# EAGLE design io-board-b-1 (EAGLE 8.4.3)
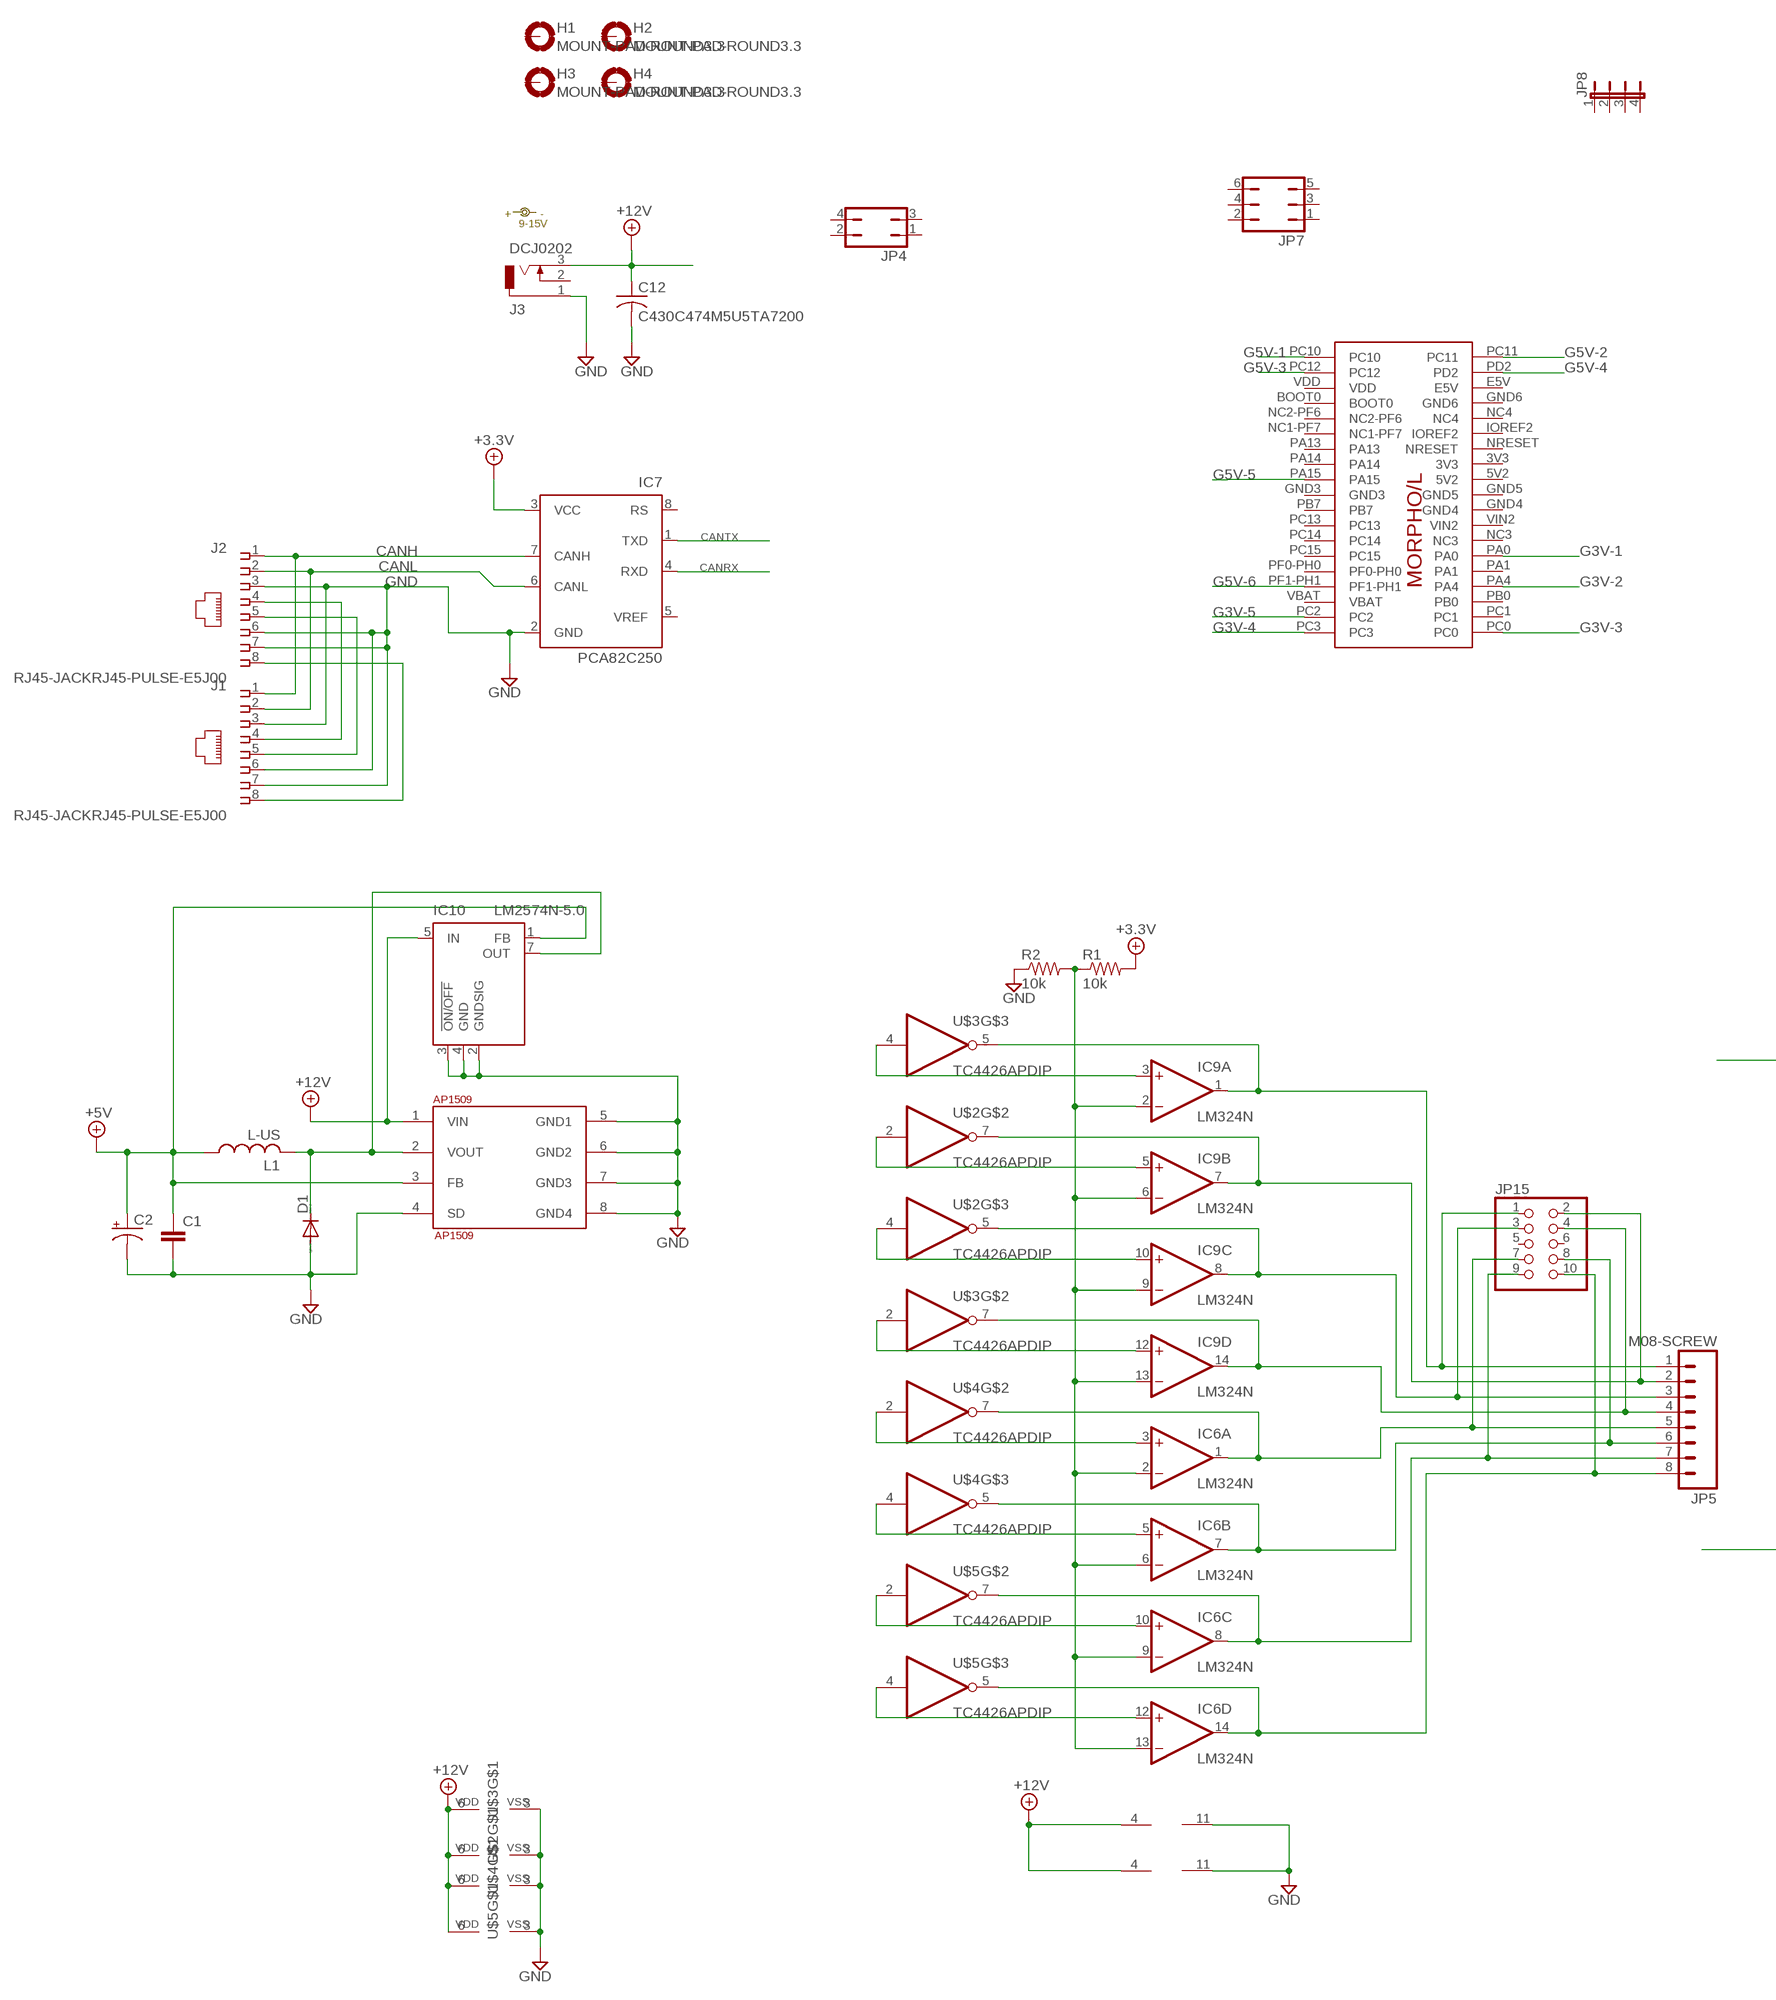
[diagram p0: schematic, sheet 1, part 1 of 2]
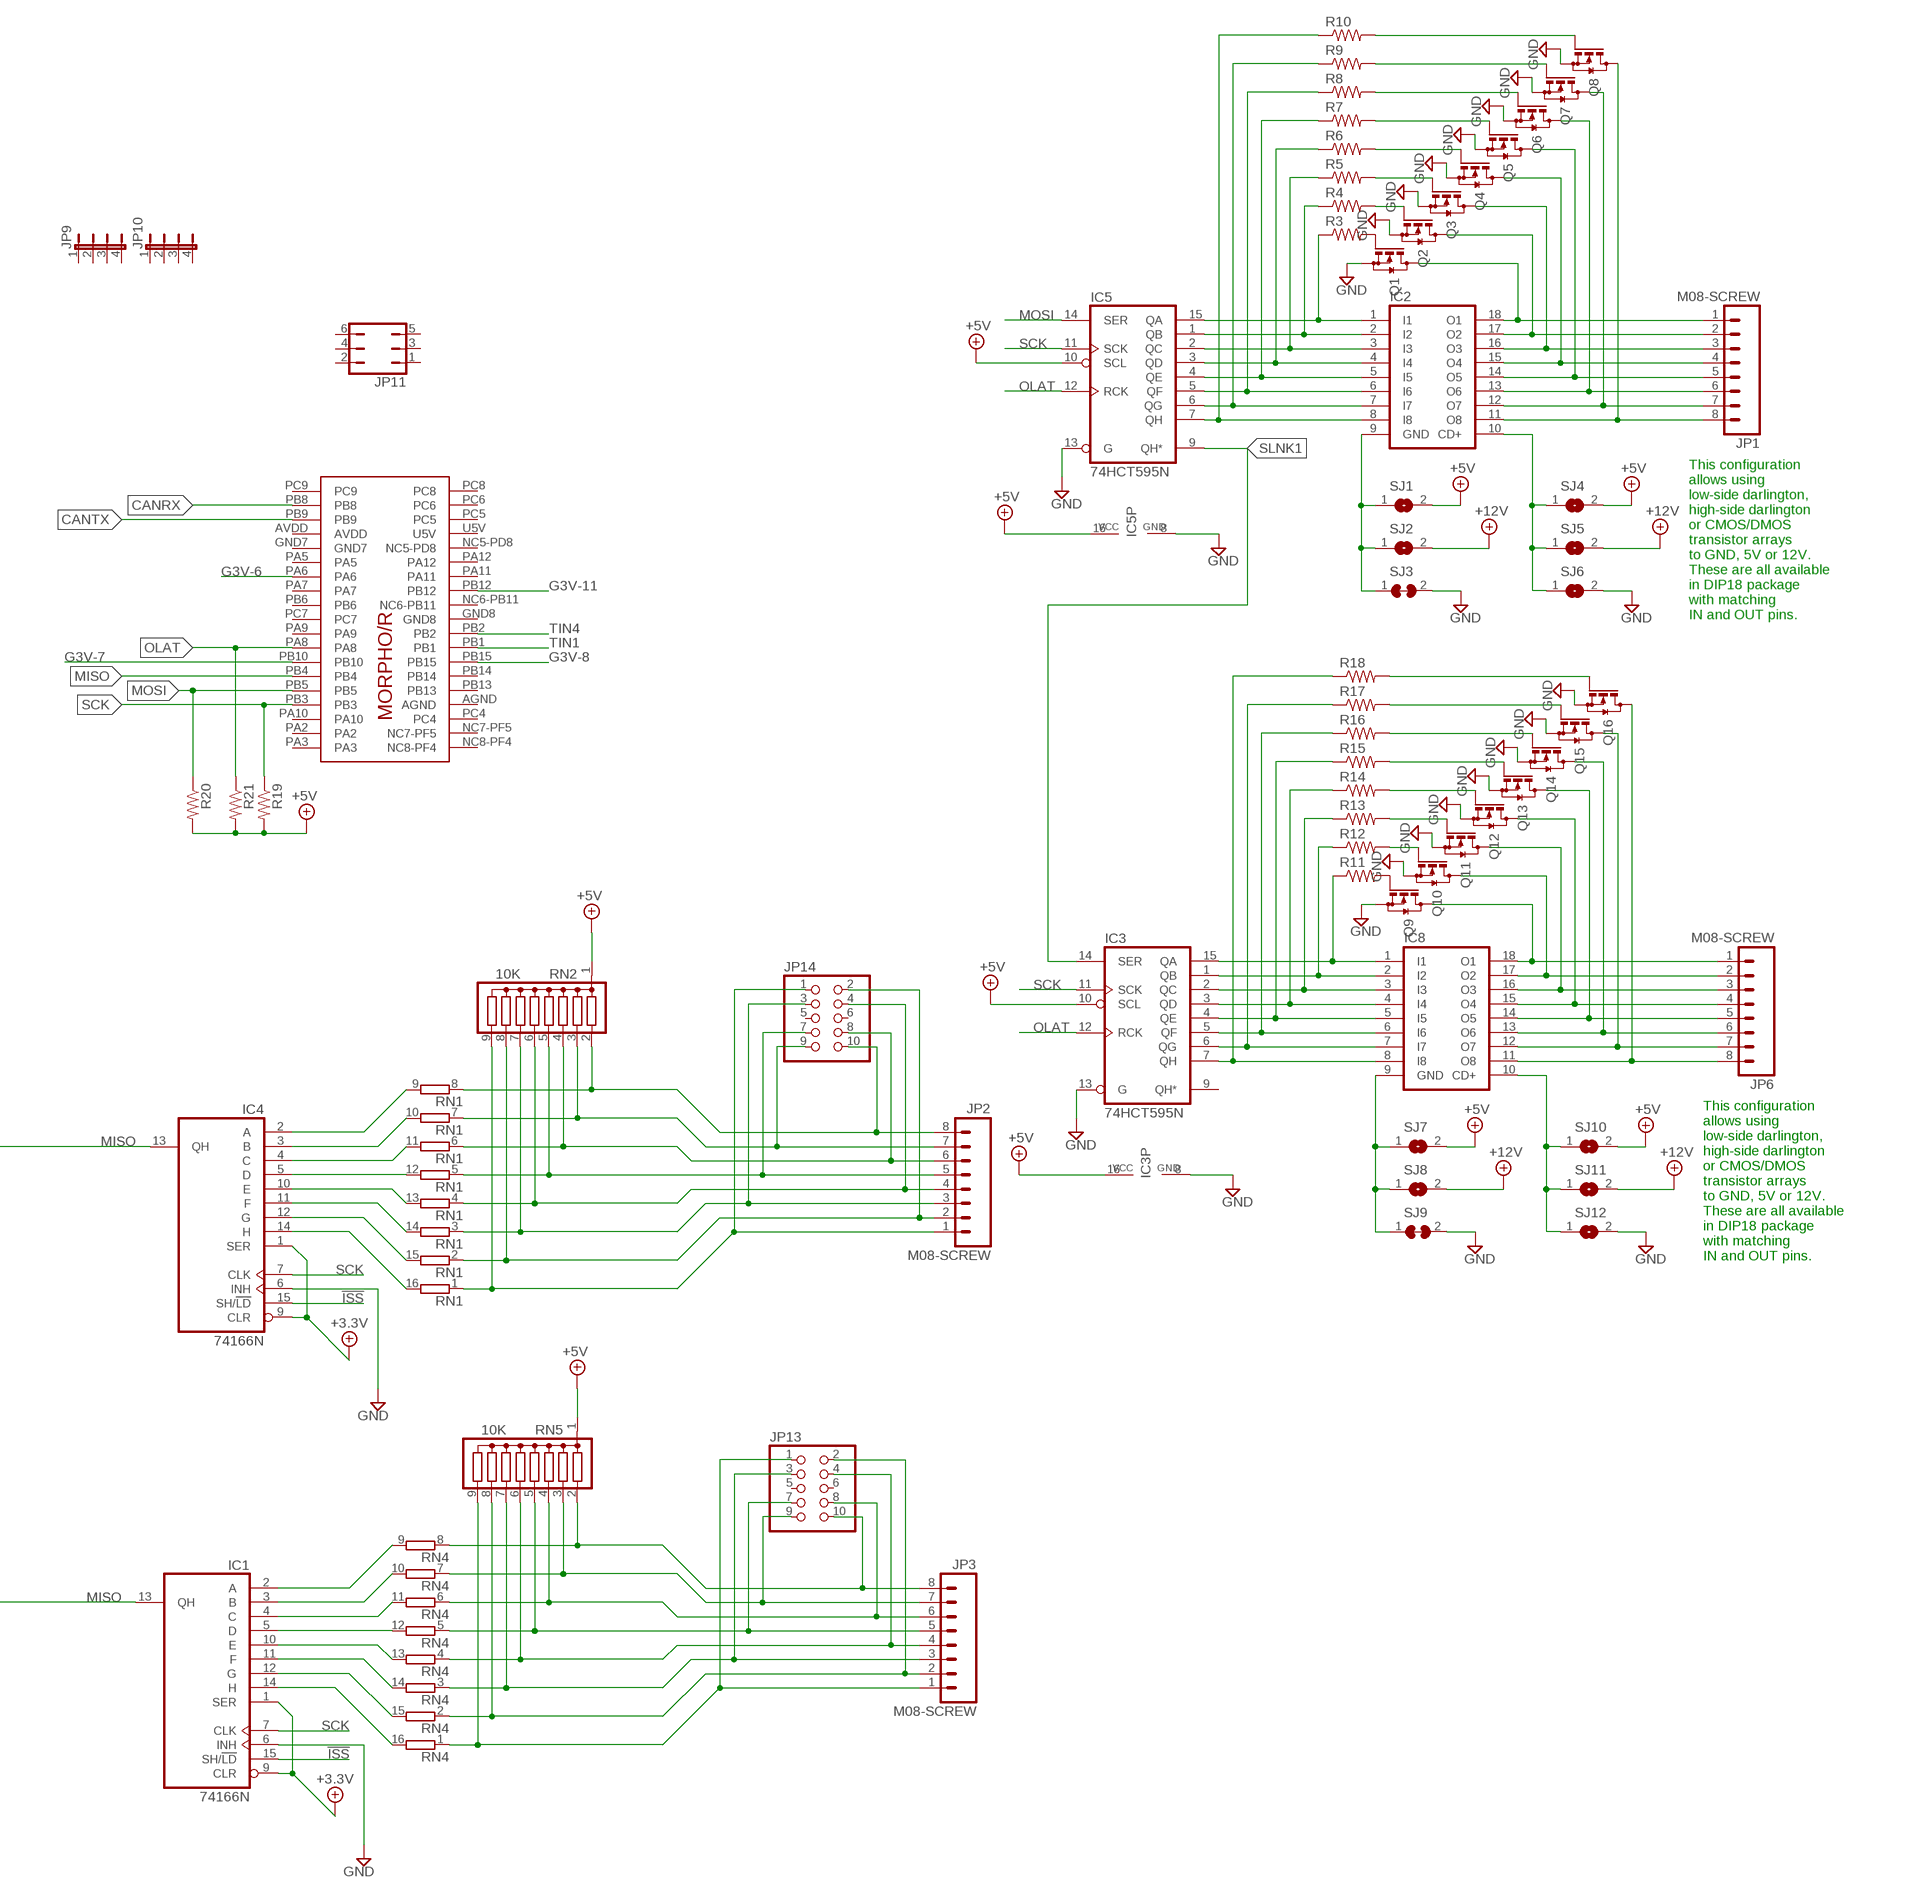
[diagram p1: schematic, sheet 1, part 2 of 2]

## Parts
+12V  9-15V  DOC-POWER_LABEL  [POWER_USAGE]
AP1509  AP1509  [SO-08]
C1  C-EUC1206  [C1206]
C2  CPOL-USE2.5-5  [E2,5-5]
C12  C430C474M5U5TA7200  C-US075-032X103  [C075-032X103]
D1  DIODE-DO41-7.6  [DO41-7.6]
H1  MOUNT-PAD-ROUND3.3  [3,3-PAD]
H2  MOUNT-PAD-ROUND3.3  [3,3-PAD]
H3  MOUNT-PAD-ROUND3.3  [3,3-PAD]
H4  MOUNT-PAD-ROUND3.3  [3,3-PAD]
IC1  74166N  [DIL16]
IC2  ULN2803A  [DIL18-THIN]
IC3  74HCT595N  [DIL16]
IC4  74166N  [DIL16]
IC5  74HCT595N  [DIL16]
IC6  LM324N  [DIL14]
IC7  PCA82C250  [DIL08]
IC8  ULN2803A  [DIL18-THIN]
IC9  LM324N  [DIL14]
IC10  LM2574N-5.0  [DIL08]
J1  RJ45-JACKRJ45-PULSE-E5J00  [RJ45-PULSE-E5J88]
J2  RJ45-JACKRJ45-PULSE-E5J00  [RJ45-PULSE-E5J88]
J3  DCJ0202  [DCJ0202]
JP1  M08-SCREW  [1X08_TERMINAL]
JP2  M08-SCREW  [1X08_TERMINAL]
JP3  M08-SCREW  [1X08_TERMINAL]
JP4  JP2Q  [JP2Q]
JP5  M08-SCREW  [1X08_TERMINAL]
JP6  M08-SCREW  [1X08_TERMINAL]
JP7  JP3Q  [JP3Q]
JP8  JP4-FLAT  [JP4F]
JP9  JP4-FLAT  [JP4F]
JP10  JP4-FLAT  [JP4F]
JP11  JP3Q  [JP3Q]
JP13  PINHD-2X5CN  [CON10M]
JP14  PINHD-2X5CN  [CON10M]
JP15  PINHD-2X5CN  [CON10M]
L1  L-US  [L5-8,5]
Q1  BSS123  [SOT23]
Q2  BSS123  [SOT23]
Q3  BSS123  [SOT23]
Q4  BSS123  [SOT23]
Q5  BSS123  [SOT23]
Q6  BSS123  [SOT23]
Q7  BSS123  [SOT23]
Q8  BSS123  [SOT23]
Q9  BSS123  [SOT23]
Q10  BSS123  [SOT23]
Q11  BSS123  [SOT23]
Q12  BSS123  [SOT23]
Q13  BSS123  [SOT23]
Q14  BSS123  [SOT23]
Q15  BSS123  [SOT23]
Q16  BSS123  [SOT23]
R1  10k  R-US_R1206  [R1206]
R2  10k  R-US_R1206  [R1206]
R3  R-US_R0603  [R0603]
R4  R-US_R0603  [R0603]
R5  R-US_R0603  [R0603]
R6  R-US_R0603  [R0603]
R7  R-US_R0603  [R0603]
R8  R-US_R0603  [R0603]
R9  R-US_R0603  [R0603]
R10  R-US_R0603  [R0603]
R11  R-US_R0603  [R0603]
R12  R-US_R0603  [R0603]
R13  R-US_R0603  [R0603]
R14  R-US_R0603  [R0603]
R15  R-US_R0603  [R0603]
R16  R-US_R0603  [R0603]
R17  R-US_R0603  [R0603]
R18  R-US_R0603  [R0603]
R19  R-US_R0805  [R0805]
R20  R-US_R0805  [R0805]
R21  R-US_R0805  [R0805]
RN1  8R-P  [DIL16]
RN2  10K  G08R  [SIL9]
RN4  8R-P  [DIL16]
RN5  10K  G08R  [SIL9]
SJ1  SJ  [SJ-RND]
SJ2  SJ  [SJ-RND]
SJ3  SJ-C  [SJW-C]
SJ4  SJ  [SJ-RND]
SJ5  SJ  [SJ-RND]
SJ6  SJ  [SJ-RND]
SJ7  SJ  [SJ-RND]
SJ8  SJ  [SJ-RND]
SJ9  SJ-C  [SJW-C]
SJ10  SJ  [SJ-RND]
SJ11  SJ  [SJ-RND]
SJ12  SJ  [SJ-RND]
U$1  NUCLEO_64_GENERIC  [NUCLEO_BRD_BASE64]
U$2  TC4426APDIP  [DIL08-LONG]
U$3  TC4426APDIP  [DIL08-LONG]
U$4  TC4426APDIP  [DIL08-LONG]
U$5  TC4426APDIP  [DIL08-LONG]

## Nets
!ISS: IC1.15(SH/!LD) IC4.15(SH/!LD)
+3.3V: IC1.1(SER) IC1.9(CLR) IC4.1(SER) IC4.9(CLR) IC7.3(VCC) R1.2
+5V: AP1509.3(FB) C1.1 C2.+ IC3.10(SCL) IC3.16(VCC) IC5.10(SCL) IC5.16(VCC) IC10.1(FB) L1.1 R19.2 R20.2 R21.2 RN2.1 RN5.1 SJ1.2 SJ4.2 SJ7.2 SJ10.2
+12V: AP1509.1(VIN) C12.1 IC6.4(P:V+) IC9.4(P:V+) IC10.5(IN) J3.3 SJ2.2 SJ5.2 SJ8.2 SJ11.2 U$2.6(VDD) U$3.6(VDD) U$4.6(VDD) U$5.6(VDD)
CANH: IC7.7(CANH) J1.1 J2.1
CANL: IC7.6(CANL) J1.2 J2.2
CANRX: IC7.4(RXD) U$1.PB8
CANTX: IC7.1(TXD) U$1.PB9
CMPREF: IC6.2(A:-IN) IC6.6(B:-IN) IC6.9(C:-IN) IC6.13(D:-IN) IC9.2(A:-IN) IC9.6(B:-IN) IC9.9(C:-IN) IC9.13(D:-IN) R1.1 R2.2
G3V-1: U$1.PA0
G3V-2: U$1.PA4
G3V-3: U$1.PC0
G3V-4: U$1.PC3
G3V-5: U$1.PC2
G3V-6: U$1.PA6
G3V-7: U$1.PB10
G3V-8: U$1.PB15
G3V-11: U$1.PB12
G5V-1: U$1.PC10
G5V-2: U$1.PC11
G5V-3: U$1.PC12
G5V-4: U$1.PD2
G5V-5: U$1.PA15
G5V-6: U$1.PF1-PH1
GND: AP1509.4(SD) AP1509.5(GND1) AP1509.6(GND2) AP1509.7(GND3) AP1509.8(GND4) C1.2 C2.- C12.2 D1.A IC1.6(INH) IC3.8(GND) IC3.13(G) IC4.6(INH) IC5.8(GND) IC5.13(G) IC6.11(P:V-) IC7.2(GND) IC9.11(P:V-) IC10.2(GNDSIG) IC10.3(!ON/OFF) IC10.4(GND) J1.3 J1.6 J1.7 J2.3 J2.6 J2.7 J3.1 Q1.2(S) Q2.2(S) Q3.2(S) Q4.2(S) Q5.2(S) Q6.2(S) Q7.2(S) Q8.2(S) Q9.2(S) Q10.2(S) Q11.2(S) Q12.2(S) Q13.2(S) Q14.2(S) Q15.2(S) Q16.2(S) R2.1 SJ3.2 SJ6.2 SJ9.2 SJ12.2 U$2.3(VSS) U$3.3(VSS) U$4.3(VSS) U$5.3(VSS)
MISO: IC1.13(QH) IC4.13(QH) U$1.PB4
MOSI: IC5.14(SER) R20.1 U$1.PB5
N$1: IC2.1(I1) IC5.15(QA) R3.1
N$2: IC2.18(O1) JP1.1 Q1.3(D)
N$3: IC2.2(I2) IC5.1(QB) R4.1
N$4: J1.4 J2.4
N$5: J1.5 J2.5
N$6: JP3.8 JP13.10 RN4.8 RN5.2
N$7: IC2.17(O2) JP1.2 Q2.3(D)
N$8: IC2.3(I3) IC5.2(QC) R5.1
N$9: IC2.16(O3) JP1.3 Q3.3(D)
N$10: IC2.4(I4) IC5.3(QD) R6.1
N$11: IC2.15(O4) JP1.4 Q4.3(D)
N$12: IC2.5(I5) IC5.4(QE) R7.1
N$13: IC2.14(O5) JP1.5 Q5.3(D)
N$14: JP3.7 JP13.9 RN4.7 RN5.3
N$15: JP3.6 JP13.8 RN4.6 RN5.4
N$16: Q4.1(G) R6.2
N$17: IC2.6(I6) IC5.5(QF) R8.1
N$18: IC2.13(O6) JP1.6 Q6.3(D)
N$19: JP3.4 JP13.4 RN4.4 RN5.6
N$20: JP3.3 JP13.3 RN4.3 RN5.7
N$21: JP2.6 JP14.8 RN1.6 RN2.4
N$22: JP3.1 JP13.1 RN4.1 RN5.9
N$23: IC1.2(A) RN4.9
N$24: IC1.3(B) RN4.10
N$25: JP2.8 JP14.10 RN1.8 RN2.2
N$26: JP2.7 JP14.9 RN1.7 RN2.3
N$27: Q5.1(G) R7.2
N$28: JP2.5 JP14.7 RN1.5 RN2.5
N$29: IC1.4(C) RN4.11
N$30: IC1.5(D) RN4.12
N$31: IC1.10(E) RN4.13
N$32: IC1.11(F) RN4.14
N$33: JP2.4 JP14.4 RN1.4 RN2.6
N$34: JP2.3 JP14.3 RN1.3 RN2.7
N$35: JP2.2 JP14.2 RN1.2 RN2.8
N$36: JP2.1 JP14.1 RN1.1 RN2.9
N$37: IC1.12(G) RN4.15
N$38: IC1.14(H) RN4.16
N$39: IC2.7(I7) IC5.6(QG) R9.1
N$40: IC2.12(O7) JP1.7 Q7.3(D)
N$41: IC2.8(I8) IC5.7(QH) R10.1
N$42: IC2.11(O8) JP1.8 Q8.3(D)
N$43: Q6.1(G) R8.2
N$44: IC4.2(A) RN1.9
N$47: IC4.3(B) RN1.10
N$48: IC4.4(C) RN1.11
N$49: IC4.5(D) RN1.12
N$50: IC4.10(E) RN1.13
N$51: IC4.11(F) RN1.14
N$52: IC4.12(G) RN1.15
N$53: IC4.14(H) RN1.16
N$54: IC2.9(GND) SJ1.1 SJ2.1 SJ3.1
N$55: IC2.10(CD+) SJ4.1 SJ5.1 SJ6.1
N$56: IC3.15(QA) IC8.1(I1) R11.1
N$65: Q7.1(G) R9.2
N$75: IC8.11(O8) JP6.8 Q16.3(D)
N$76: IC8.9(GND) SJ7.1 SJ8.1 SJ9.1
N$77: IC8.10(CD+) SJ10.1 SJ11.1 SJ12.1
N$78: Q1.1(G) R3.2
N$79: Q2.1(G) R4.2
N$83: JP3.5 JP13.7 RN4.5 RN5.5
N$84: JP3.2 JP13.2 RN4.2 RN5.8
N$85: Q8.1(G) R10.2
N$87: IC8.18(O1) JP6.1 Q9.3(D)
N$88: Q3.1(G) R5.2
N$89: IC3.1(QB) IC8.2(I2) R12.1
N$91: IC8.17(O2) JP6.2 Q10.3(D)
N$92: IC3.2(QC) IC8.3(I3) R13.1
N$93: IC8.16(O3) JP6.3 Q11.3(D)
N$94: IC3.3(QD) IC8.4(I4) R14.1
N$95: IC8.15(O4) JP6.4 Q12.3(D)
N$96: IC3.4(QE) IC8.5(I5) R15.1
N$97: IC8.14(O5) JP6.5 Q13.3(D)
N$98: IC3.5(QF) IC8.6(I6) R16.1
N$99: IC8.13(O6) JP6.6 Q14.3(D)
N$100: IC3.6(QG) IC8.7(I7) R17.1
N$101: IC8.12(O7) JP6.7 Q15.3(D)
N$102: IC3.7(QH) IC8.8(I8) R18.1
N$104: Q9.1(G) R11.2
N$105: Q10.1(G) R12.2
N$106: Q11.1(G) R13.2
N$107: Q12.1(G) R14.2
N$108: Q13.1(G) R15.2
N$109: Q14.1(G) R16.2
N$110: Q15.1(G) R17.2
N$111: Q16.1(G) R18.2
OLAT: IC3.12(RCK) IC5.12(RCK) R21.1 U$1.PA8
PWR_POS: J1.8 J2.8
SCK: IC1.7(CLK) IC3.11(SCK) IC4.7(CLK) IC5.11(SCK) R19.1 U$1.PB3
SLNK1: IC3.14(SER) IC5.9(QH*)
SW: AP1509.2(VOUT) D1.C IC10.7(OUT) L1.2
TIN1: IC9.3(A:+IN) U$1.PB1 U$3.4(I)
TIN2: IC9.5(B:+IN) U$2.2(I)
TIN3: IC9.10(C:+IN) U$2.4(I)
TIN4: IC9.12(D:+IN) U$1.PB2 U$3.2(I)
TIN5: IC6.3(A:+IN) U$4.2(I)
TIN6: IC6.5(B:+IN) U$4.4(I)
TIN7: IC6.10(C:+IN) U$5.2(I)
TIN8: IC6.12(D:+IN) U$5.4(I)
TOUT1: IC9.1(A:OUT) JP5.1 JP15.1 U$3.5(O)
TOUT2: IC9.7(B:OUT) JP5.2 JP15.2 U$2.7(O)
TOUT3: IC9.8(C:OUT) JP5.3 JP15.3 U$2.5(O)
TOUT4: IC9.14(D:OUT) JP5.4 JP15.4 U$3.7(O)
TOUT5: IC6.1(A:OUT) JP5.5 JP15.7 U$4.7(O)
TOUT6: IC6.7(B:OUT) JP5.6 JP15.8 U$4.5(O)
TOUT7: IC6.8(C:OUT) JP5.7 JP15.9 U$5.7(O)
TOUT8: IC6.14(D:OUT) JP5.8 JP15.10 U$5.5(O)
Unconnected: H1.B3,3(MOUNT) H2.B3,3(MOUNT) H3.B3,3(MOUNT) H4.B3,3(MOUNT) IC3.9(QH*) IC7.5(VREF) IC7.8(RS) J3.2 JP4.1 JP4.2 JP4.3 JP4.4 JP7.1 JP7.2 JP7.3 JP7.4 JP7.5 JP7.6 JP8.1 JP8.2 JP8.3 JP8.4 JP9.1 JP9.2 JP9.3 JP9.4 JP10.1 JP10.2 JP10.3 JP10.4 JP11.1 JP11.2 JP11.3 JP11.4 JP11.5 JP11.6 JP13.5 JP13.6 JP14.5 JP14.6 JP15.5 JP15.6 U$1.BOOT0 U$1.IOREF2 U$1.NC1-PF7 U$1.NC2-PF6 U$1.NC3 U$1.NC4 U$1.NC5-PD8 U$1.NC6-PB11 U$1.NC7-PF5 U$1.NC8-PF4 U$1.NRESET U$1.PA1 U$1.PA2 U$1.PA3 U$1.PA5 U$1.PA7 U$1.PA9 U$1.PA10 U$1.PA11 U$1.PA12 U$1.PA13 U$1.PA14 U$1.PB0 U$1.PB6 U$1.PB7 U$1.PB13 U$1.PB14 U$1.PC1 U$1.PC4 U$1.PC5 U$1.PC6 U$1.PC7 U$1.PC8 U$1.PC9 U$1.PC13 U$1.PC14 U$1.PC15 U$1.PF0-PH0

## Notes on the sheet
- This configuration
  allows using
  low-side darlington,
  high-side darlington
  or CMOS/DMOS 
  transistor arrays 
  to GND, 5V or 12V. 
  These are all available 
  in DIP18 package 
  with matching 
  IN and OUT pins.
- This configuration
  allows using
  low-side darlington,
  high-side darlington
  or CMOS/DMOS 
  transistor arrays 
  to GND, 5V or 12V. 
  These are all available 
  in DIP18 package 
  with matching 
  IN and OUT pins.

## Power pins joined to a net without a drawn wire
3V3: U$1.3V3
5V2: U$1.5V2
AGND: U$1.AGND
AVDD: U$1.AVDD
E5V: U$1.E5V
GND: IC1.8(GND) IC4.8(GND)
GND3: U$1.GND3
GND4: U$1.GND4
GND5: U$1.GND5
GND6: U$1.GND6
GND7: U$1.GND7
GND8: U$1.GND8
U5V: U$1.U5V
VBAT: U$1.VBAT
VCC: IC1.16(VCC) IC4.16(VCC)
VDD: U$1.VDD
VIN2: U$1.VIN2

## Library data of the parts
+12V = SPCoast:DOC-POWER_LABEL
AP1509 = trainlib:AP1509
C1 = rcl:C-EU: CAPACITOR, European symbol
C2 = rcl:CPOL-US: POLARIZED CAPACITOR, American symbol
C12 = rcl:C-US: CAPACITOR, American symbol
D1 = diode:DIODE-: DIODE
H1-H4 = holes:MOUNT-PAD-ROUND: MOUNTING PAD, round
IC1 IC4 = 74xx-us:74*166: 8-bit parallel load SHIFT REGISTER
IC2 IC8 = trainlib:ULN2803A: DRIVER ARRAY
IC3 IC5 = 74xx-eu:74*595: 8-bit SHIFT REGISTER, output latch
IC6 IC9 = linear:LM324: OP AMP
IC7 = micro-philips:PCA82C250: CAN CONTROLLER INTERFACE; OC_FARNELL: 3692358; OC_NEWARK: unknown
IC10 = linear:LM2574?-*: SIMPLE SWITCHER 0.5A Step-Down Voltage Regulator Source: http://cache.national.com/ds/LM/LM2574.pdf
J1 J2 = trainlib:RJ45-JACK: Mod. Jack, Right Angle, 8 posiotion, 8 contatcs RJ45 Source: GLX-S-88M.pdf
J3 = con-jack:DCJ0202: DC POWER JACK Source: DCJ0202.pdf; OC_FARNELL: unknown; OC_NEWARK: unknown
JP1-JP3 JP5 JP6 = trainlib:M08-SCREW
JP4 = jumper:JP2Q: JUMPER
JP7 JP11 = jumper:JP3Q: JUMPER
JP8-JP10 = trainlib:JP4-FLAT: JUMPER
JP13-JP15 = trainlib:PINHD-2X5: PIN HEADER
L1 = trainlib:L-US
Q1-Q16 = transistor-small-signal:BSS123: N-CHANNEL MOS FET
R1-R21 = rcl:R-US_: RESISTOR, American symbol
RN1 RN4 = resistor-dil:8R-P: DIL RESISTOR; OC_FARNELL: unknown; OC_NEWARK: unknown
RN2 RN5 = resistor-sil:G08R: SIL RESISTOR; OC_FARNELL: unknown; OC_NEWARK: unknown
SJ1 SJ2 SJ4-SJ8 SJ10-SJ12 = trainlib:SJ: SMD solder JUMPER
SJ3 SJ9 = trainlib:SJ-C
U$1 = trainlib:NUCLEO_64_GENERIC
U$2-U$5 = trainlib:TC4426A: The TC4426A (dual inverter), 4427A (dual buffer) and 4428A (buffer+inverter) are improved buffer/drivers. They will not latch up under any conditions within their power and voltage ratings. They are not subject to damage when up to 5V of noise spiking (of either polarity) occurs on the ground pin. They can accept, without damage or logic upset, up to 500 mA of reverse current (of either polarity) being forced back into their outputs. All terminals are fully protected against up to 4 kV of electrostatic discharge. As MOSFET drivers, the TC4426A/4427A/4428A can easily switch 1000 pF gate capacitances in under 30 ns, and provide low enough impedances in both the ON and OFF states to ensure the MOSFET's intended state will not be affected, even by large transients.

## Board
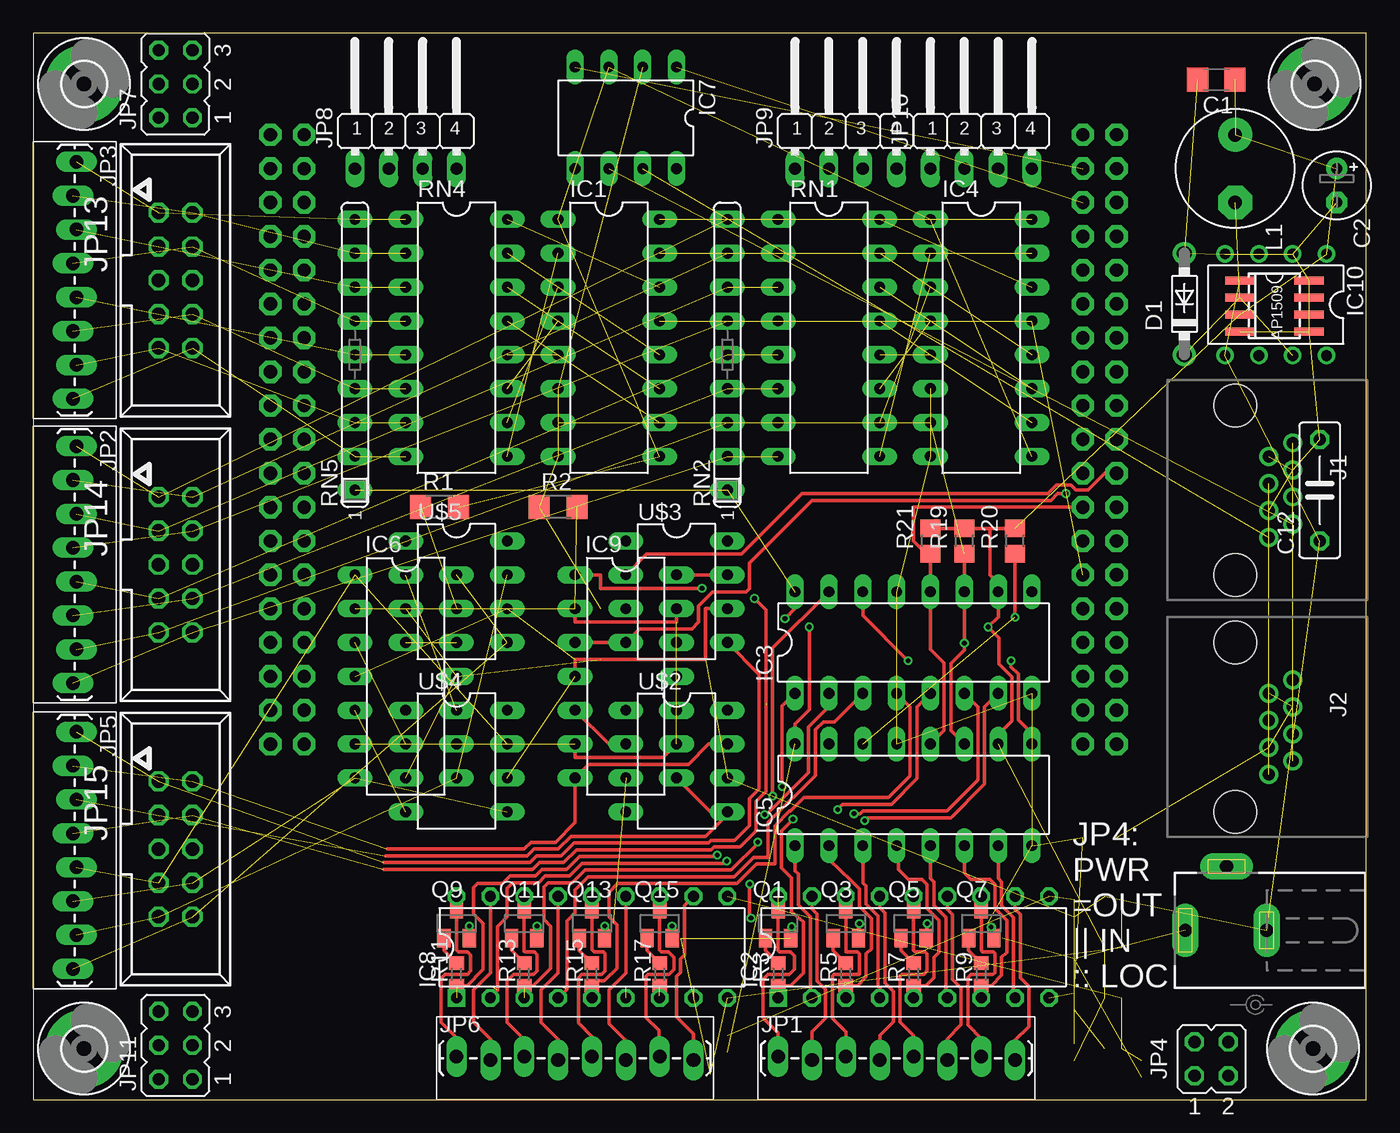
[diagram p2: board, top side]
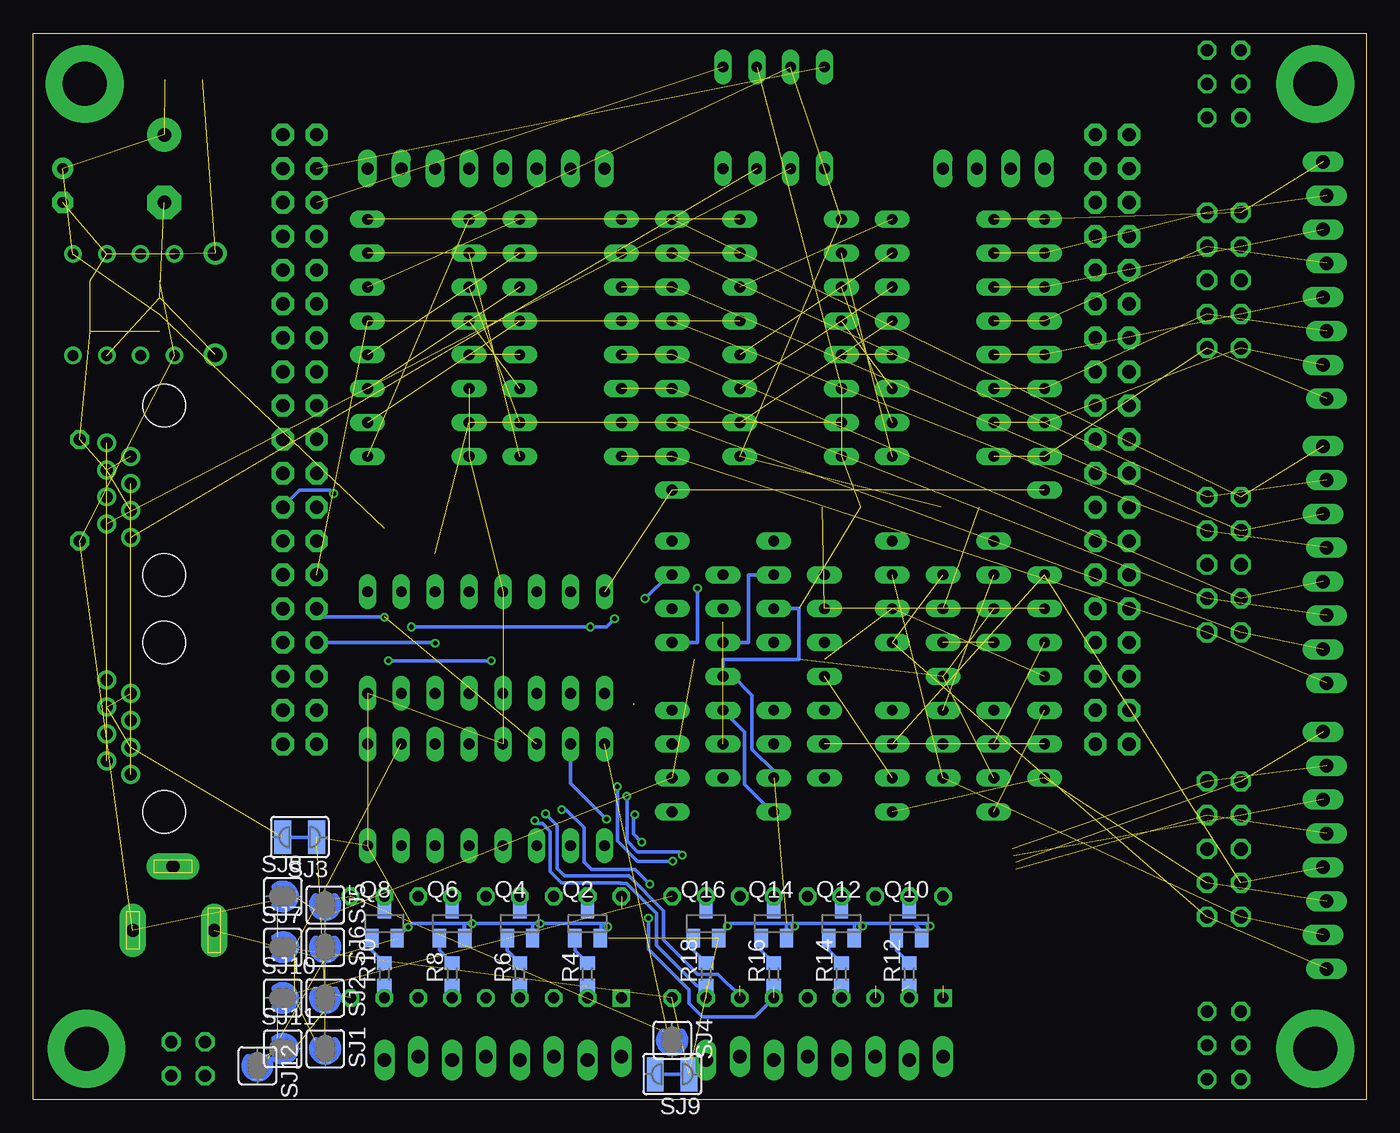
[diagram p3: board, bottom side, seen from below]

Size 100 x 80 mm. Coordinates in mm from the lower left corner, seen from the top.
Outline: 0,0 100,0 100,80 0,80 0,0
Copper layers (1*16): Top 0.035mm / dielectric 1.5mm / Bottom 0.035mm
Design rules "SeeedStudio_2layer_DRU_no_angle_20140221 *": minimum track width 6mil, minimum drill 12mil, track to track 10mil, track to pad 7mil, pad to pad 6mil, via to via 6mil, smd to smd 0mil, copper to edge 10mil, drill to drill 10mil, minimum pad ring 10mil, minimum via ring 6mil, stop-mask expansion 2mil, vias tented up to drill 100mil, thermal gap 10mil

### Footprints (pad centres in the part's own frame; a part is rotated, then mirrored left to right if it is on the bottom)
SO-08 = smd 0.6 x 2.2: 1 -1.905,-2.6; 2 -0.635,-2.6; 3 0.635,-2.6; 4 1.905,-2.6; 5 1.905,2.6; 6 0.635,2.6; 7 -0.635,2.6; 8 -1.905,2.6
C1206 = smd 1.6 x 1.8: 1 -1.4,0; 2 1.4,0
E2,5-5 = drill 0.813 pad 1.6: + -1.27,0 | drill 0.813 pad 1.6 octagon: - 1.27,0
C075-032X103 = drill 0.914 octagon: 1 -3.81,0; 2 3.81,0
DO41-7.6 = drill 1.1 pad 1.7: A 3.81,0; C -3.81,0
3,3-PAD = drill 3.3 pad 5.842: B3,3 0,0
DIL16 = drill 0.813 long: 1 -8.89,-3.81; 2 -6.35,-3.81; 3 -3.81,-3.81; 4 -1.27,-3.81; 5 1.27,-3.81; 6 3.81,-3.81; 7 6.35,-3.81; 8 8.89,-3.81; 9 8.89,3.81; 10 6.35,3.81; 11 3.81,3.81; 12 1.27,3.81; 13 -1.27,3.81; 14 -3.81,3.81; 15 -6.35,3.81; 16 -8.89,3.81
DIL18-THIN = drill 0.813 square: 1 -10.16,-3.81 | drill 0.813 octagon: 2 -7.62,-3.81; 3 -5.08,-3.81; 4 -2.54,-3.81; 5 0,-3.81; 6 2.54,-3.81; 7 5.08,-3.81; 8 7.62,-3.81; 9 10.16,-3.81; 10 10.16,3.81; 11 7.62,3.81; 12 5.08,3.81; 13 2.54,3.81; 14 0,3.81; 15 -2.54,3.81; 16 -5.08,3.81; 17 -7.62,3.81; 18 -10.16,3.81
DIL14 = drill 0.813 long: 1 -7.62,-3.81; 2 -5.08,-3.81; 3 -2.54,-3.81; 4 0,-3.81; 5 2.54,-3.81; 6 5.08,-3.81; 7 7.62,-3.81; 8 7.62,3.81; 9 5.08,3.81; 10 2.54,3.81; 11 0,3.81; 12 -2.54,3.81; 13 -5.08,3.81; 14 -7.62,3.81
DIL08 = drill 0.813 long: 1 -3.81,-3.81; 2 -1.27,-3.81; 3 1.27,-3.81; 4 3.81,-3.81; 5 3.81,3.81; 6 1.27,3.81; 7 -1.27,3.81; 8 -3.81,3.81
DIL08' = drill 0.813 pad 1.27: 1 -3.81,-3.81; 2 -1.27,-3.81; 3 1.27,-3.81; 4 3.81,-3.81; 5 3.81,3.81; 6 1.27,3.81; 7 -1.27,3.81; 8 -3.81,3.81
RJ45-PULSE-E5J88 = drill 0.9 pad 1.422: 1 3.555,2.54; 2 2.535,4.32; 3 1.515,2.54; 4 0.495,4.32; 5 -0.495,2.54; 6 -1.515,4.32; 7 -2.535,2.54; 8 -3.555,4.32 | hole 3.2: 6.35,0; -6.35,0
DCJ0202 = drill 1 pad 2 long: 1 0,3.1; 2 4.8,0; 3 0,-3
1X08_TERMINAL = drill 1.016 long: 1 0,0.127; 2 2.54,-0.127; 3 5.08,0.127; 4 7.62,-0.127; 5 10.16,0.127; 6 12.7,-0.127; 7 15.24,0.127; 8 17.78,-0.127
JP2Q = drill 0.914 octagon: 1 -1.27,-1.27; 2 -1.27,1.27; 3 1.27,-1.27; 4 1.27,1.27
JP3Q = drill 0.914 octagon: 1 -2.54,-1.27; 2 -2.54,1.27; 3 0,-1.27; 4 0,1.27; 5 2.54,-1.27; 6 2.54,1.27
JP4F = drill 0.914 long: 1 -2.54,-1.27; 2 0,-1.27; 3 2.54,-1.27; 4 5.08,-1.27
CON10M = drill 1 octagon: 1 -5.08,-1.27; 2 -5.08,1.27; 3 -2.54,-1.27; 4 -2.54,1.27; 5 0,-1.27; 6 0,1.27; 7 2.54,-1.27; 8 2.54,1.27; 9 5.08,-1.27; 10 5.08,1.27
L5-8,5 = drill 1.016 pad 2.54: 1 -2.54,0 | drill 1.016 pad 2.54 octagon: 2 2.54,0
SOT23 = smd 1 x 1.4: 1 -0.95,-1.1; 2 0.95,-1.1; 3 0,1.1
R1206 = smd 1.6 x 1.803: 1 -1.422,0; 2 1.422,0
R0603 = smd 1 x 1.1: 1 -0.85,0; 2 0.85,0
R0805 = smd 1.3 x 1.5: 1 -0.95,0; 2 0.95,0
SIL9 = drill 0.813 long: 1 -10.16,0; 2 -7.62,0; 3 -5.08,0; 4 -2.54,0; 5 0,0; 6 2.54,0; 7 5.08,0; 8 7.62,0; 9 10.16,0
SJ-RND = smd 1.016 x 0.508: 1 -0.381,0 | smd 0.406 x 0.813: 2 0.889,0
SJW-C = smd 1.27 x 2.54: 1 -1.27,0; 2 1.27,0
NUCLEO_BRD_BASE64 = drill 1 pad 1.676 octagon: 3V3 2.54,27.94; 5V2 2.54,25.4; AGND 63.5,7.62; AVDD 60.96,38.1; BOOT0 0,38.1; E5V 2.54,40.64; GND3 0,22.86; GND4 2.54,20.32; GND5 2.54,22.86; GND6 2.54,38.1; GND7 60.96,35.56; GND8 63.5,22.86; IOREF2 2.54,33.02; NC1-PF7 0,33.02; NC2-PF6 0,35.56; NC3 2.54,15.24; NC4 2.54,35.56; NC5-PD8 63.5,35.56; NC6-PB11 63.5,25.4; NC7-PF5 63.5,2.54; NC8-PF4 63.5,0; NRESET 2.54,30.48; PA0 2.54,12.7; PA1 2.54,10.16; PA2 60.96,2.54; PA3 60.96,0; PA4 2.54,7.62; PA5 60.96,33.02; PA6 60.96,30.48; PA7 60.96,27.94; PA8 60.96,17.78; PA9 60.96,20.32; PA10 60.96,5.08; PA11 63.5,30.48; PA12 63.5,33.02; PA13 0,30.48; PA14 0,27.94; PA15 0,25.4; PB0 2.54,5.08; PB1 63.5,17.78; PB2 63.5,20.32; PB3 60.96,7.62; PB4 60.96,12.7; PB5 60.96,10.16; PB6 60.96,25.4; PB7 0,20.32; PB8 60.96,43.18; PB9 60.96,40.64; PB10 60.96,15.24; PB12 63.5,27.94; PB13 63.5,10.16; PB14 63.5,12.7; PB15 63.5,15.24; PC0 2.54,0; PC1 2.54,2.54; PC2 0,2.54; PC3 0,0; PC4 63.5,5.08; PC5 63.5,40.64; PC6 63.5,43.18; PC7 60.96,22.86; PC8 63.5,45.72; PC9 60.96,45.72; PC10 0,45.72; PC11 2.54,45.72; PC12 0,43.18; PC13 0,17.78; PC14 0,15.24; PC15 0,12.7; PD2 2.54,43.18; PF0-PH0 0,10.16; PF1-PH1 0,7.62; U5V 63.5,38.1; VBAT 0,5.08; VDD 0,40.64; VIN2 2.54,17.78
DIL08-LONG = drill 0.813 long: 1 -3.81,-3.81; 2 -1.27,-3.81; 3 1.27,-3.81; 4 3.81,-3.81; 5 3.81,3.81; 6 1.27,3.81; 7 -1.27,3.81; 8 -3.81,3.81

### Placement (x,y rotation side)
+12V  91.69,7.11 270 top
AP1509  93.12,59.54 270 top
C1  88.75,76.5 180 top
C2  97.79,68.58 270 top
C12  96.52,45.72 90 top
D1  86.36,59.69 90 top
H1  3.81,76.2 0 top
H2  3.81,3.81 0 top
H3  96.01,3.81 0 top
H4  96.14,76.2 0 top
IC1  43.18,57.15 270 top
IC2  66.04,11.43 0 top
IC3  66.04,34.29 0 top
IC4  71.12,57.15 270 top
IC5  66.04,22.86 0 top
IC6  27.94,31.75 270 top
IC7  44.45,73.66 180 top
IC8  41.91,11.43 0 top
IC9  44.45,31.75 270 top
IC10  LM2574N-5.0  [DIL08']  93.22,59.64 180 top
J1  90.17,45.72 270 top
J2  90.17,27.94 270 top
J3  89.53,12.7 90 top
JP1  55.88,3.1 0 top
JP2  3.1,49.02 270 top
JP3  3.1,70.36 270 top
JP4  88.39,3.05 0 top
JP5  3.1,27.58 270 top
JP6  31.75,3.1 0 top
JP7  10.67,76.2 90 top
JP8  26.67,71.12 0 top
JP9  59.69,71.12 0 top
JP10  69.85,71.12 0 top
JP11  10.67,4.06 90 top
JP13  10.67,61.47 270 top
JP14  10.67,40.13 270 top
JP15  10.67,18.8 270 top
L1  90.17,69.85 270 top
Q1  55.88,13.21 0 top
Q2  58.42,13.21 0 bottom
Q3  60.96,13.21 0 top
Q4  63.5,13.21 0 bottom
Q5  66.04,13.21 0 top
Q6  68.58,13.21 0 bottom
Q7  71.12,13.21 0 top
Q8  73.66,13.21 0 bottom
Q9  31.75,13.21 0 top
Q10  34.29,13.21 0 bottom
Q11  36.83,13.21 0 top
Q12  39.37,13.21 0 bottom
Q13  41.91,13.21 0 top
Q14  44.45,13.21 0 bottom
Q15  46.99,13.21 0 top
Q16  49.53,13.21 0 bottom
R1  30.48,44.45 0 top
R2  39.37,44.45 0 top
R3  55.88,9.4 90 top
R4  58.42,9.4 90 bottom
R5  60.96,9.4 90 top
R6  63.5,9.4 90 bottom
R7  66.04,9.4 90 top
R8  68.58,9.4 90 bottom
R9  71.12,9.4 90 top
R10  73.66,9.4 90 bottom
R11  31.75,9.4 90 top
R12  34.29,9.4 90 bottom
R13  36.83,9.4 90 top
R14  39.37,9.4 90 bottom
R15  41.91,9.4 90 top
R16  44.45,9.4 90 bottom
R17  46.99,9.4 90 top
R18  49.53,9.4 90 bottom
R19  69.85,41.91 90 top
R20  73.66,41.91 90 top
R21  67.31,41.91 90 top
RN1  59.69,57.15 270 top
RN2  52.07,55.88 90 top
RN4  31.75,57.15 270 top
RN5  24.13,55.88 90 top
SJ1  78.11,3.81 270 bottom
SJ2  78.11,7.62 270 bottom
SJ3  80.01,19.68 180 bottom
SJ4  52.07,4.45 270 bottom
SJ5  78.11,14.61 270 bottom
SJ6  78.11,11.43 270 bottom
SJ7  81.28,11.43 0 bottom
SJ8  81.28,15.24 0 bottom
SJ9  52.07,1.91 180 bottom
SJ10  81.28,7.62 0 bottom
SJ11  81.28,3.81 0 bottom
SJ12  83.19,2.54 270 bottom
U$1  17.78,26.67 0 top
U$2  48.26,25.4 270 top
U$3  48.26,38.1 270 top
U$4  31.75,25.4 270 top
U$5  31.75,38.1 270 top

### Tracks (layer width: path | path; a pad name or v marks a point on that pad's centre or on a via)
!ISS  (1 unrouted)
+3.3V  (5 unrouted)
+5V  (via drill 0.35)  (11 unrouted)
  Top 0.254: IC3.16 57.15,36.83 v56.39,36.07 | IC5.10 72.54,26.82 72.54,27.53 73.15,28.14 73.15,28.15 73.41,28.4 73.41,31.7 72.44,32.67 72.44,34.64 v71.63,35.46 72.39,36.22 IC3.10 72.39,38.73 71.75,39.37 71.75,42.86 | IC5.16 57.15,28.19 58.22,29.26 v58.22,35.46 | 71.75,42.86 R19.2 R21.2 | R20.2 71.75,42.86
  Bottom 0.254: v56.39,36.07 57,35.46 v58.22,35.46 v71.63,35.46
+12V  (12 unrouted)
  Top 0.254: IC9.4 40.64,33.02 50.42,33.02 50.42,36.83 U$3.6
CANH  (2 unrouted)
CANL  (2 unrouted)
CANRX  (1 unrouted)
CANTX  (1 unrouted)
CMPREF  (7 unrouted)
  Top 0.254: IC9.2 40.64,35.81 48.26,35.81 IC9.13 | IC9.9 47.24,25.65 40.64,25.65 IC9.6
GND  (via drill 0.35)  (38 unrouted)
  Top 0.254: Q1.2 56.83,12.95 v56.9,12.95 | Q3.2 61.91,13.21 v61.98,13.21 | 66.93,12.11 Q5.2 67.06,12.11 v67.06,13.21 | Q7.2 72.07,12.95 v71.87,12.95 | Q13.2 42.88,12.12 v42.88,13.01 | Q11.2 37.8,12.12 v37.8,13.01 | Q9.2 32.72,12.12 v32.72,13.01 | Q15.2 47.94,12.69 v47.92,13.02
  Bottom 0.254: Q8.2 v71.87,12.95 71.61,13.21 67.69,13.21 67.69,12.17 Q6.2 67.63,13.21 v67.06,13.21 62.55,13.21 | 57.4,13.21 57.4,12.11 Q2.2 | 62.55,13.21 v61.98,13.21 57.4,13.21 | Q4.2 62.55,13.21 | v56.9,12.95 56.9,13.21 57.4,13.21 | Q16.2 v47.92,13.02 47.73,13.21 43.48,13.21 | Q10.2 33.34,12.61 33.93,13.21 | 42.88,13.21 43.48,13.21 | 42.88,13.21 38.41,13.21 | 37.8,13.21 33.93,13.21 | 37.8,13.21 38.41,13.21 | Q12.2 38.41,12.12 38.41,13.21 | Q14.2 43.48,12.12 43.48,13.21 | v42.88,13.01 42.88,13.21 | v32.72,13.01 32.72,13.21 33.93,13.21 | v37.8,13.01 37.8,13.21 | U$3.3 42.55,36.83 42.55,33.02 48.26,33.02 IC9.11 48.13,31.88 47.62,31.88 46.08,30.33 46.08,26.27 44.45,24.64 U$2.3
MISO  (2 unrouted)
MOSI  (via drill 0.35)  (1 unrouted)
  Top 0.254: R20.1 v73.66,36.2
  Bottom 0.254: v73.66,36.2 78.74,36.2 U$1.PB5
N$1  (via drill 0.35)
  Top 0.254: IC2.1 R3.1 56.81,8.55 57.78,9.53 57.78,13.34 56.9,14.1 56.9,16.64 56.13,17.4 56.13,20.17 v57,21.03
  Bottom 0.254: v57,21.03 59.69,23.72 IC5.15
N$2  (1 unrouted)
  Top 0.254: IC2.18 55.88,11.18 55.98,11.07 56.79,11.07 57.1,10.77 57.1,9.75 56.74,9.4 55.12,9.4 54.74,9.02 54.74,6.15 55.88,5 JP1.1
N$3
  Top 0.254: IC5.1 57.15,17.17 57.4,16.92 57.4,14.61 58.29,13.72 58.29,7.75 IC2.2
  Bottom 0.254: R4.1 IC2.2
N$4  (1 unrouted)
N$5  (1 unrouted)
N$6  (3 unrouted)
N$7
  Top 0.254: IC2.17 Q2.3 58.8,13.93 58.8,8.89 59.44,8.26 59.44,6.1 58.42,5.08 JP1.2 58.8,3.35
  Bottom 0.254: Q2.3 IC2.17
N$8
  Top 0.254: IC5.2 59.69,18.03 59.77,17.96 61.35,16.43 61.98,15.81 61.98,14.48 62.87,13.59 62.87,11.3 62.48,10.92 62.48,9.19 61.84,8.55 R5.1 IC2.3
N$9
  Top 0.254: IC2.16 Q3.3 60.96,11.08 61.82,11.08 61.98,10.92 61.98,9.4 60.07,9.4 59.94,9.27 59.94,6.1 60.96,5.08 JP1.3
N$10
  Top 0.254: IC5.3 62.23,16.27 62.48,16.02 62.48,14.69 63.37,13.8 63.37,8.51 63.5,8.38 IC2.4
  Bottom 0.254: R6.1 IC2.4
N$11
  Top 0.254: IC2.15 63.5,14.39 63.88,14.01 63.88,8.76 64.52,8.13 64.52,5.84 63.5,4.83 JP1.4
  Bottom 0.254: Q4.3 IC2.15
N$12
  Top 0.254: IC5.4 64.9,18.92 64.9,17.27 65.66,16.51 66.67,16.51 67.06,16.13 67.06,14.35 67.94,13.46 67.94,11.05 67.56,10.67 67.56,9.14 66.97,8.55 R7.1 IC2.5
N$13
  Top 0.254: IC2.14 Q5.3 66.04,11.18 66.14,11.07 66.9,11.07 67.06,10.92 67.06,9.65 66.8,9.4 65.15,9.4 65.02,9.27 65.02,5.84 66.04,4.83 JP1.5
N$14  (3 unrouted)
N$15  (3 unrouted)
N$16
  Bottom 0.254: R6.2 64.45,11.2 Q4.1
N$17
  Top 0.254: IC5.5 67.31,16.59 67.56,16.34 67.56,14.56 68.45,13.67 68.45,7.75 IC2.6
  Bottom 0.254: IC2.6 R8.1
N$18
  Top 0.254: IC2.13 68.58,14.26 68.96,13.88 68.96,9.02 69.6,8.38 69.6,5.59 68.58,4.57 JP1.6
  Bottom 0.254: Q6.3 IC2.13
N$19  (3 unrouted)
N$20  (3 unrouted)
N$21  (3 unrouted)
N$22  (3 unrouted)
N$23  (1 unrouted)
N$24  (1 unrouted)
N$25  (3 unrouted)
N$26  (3 unrouted)
N$27
  Top 0.254: R7.2 65.09,11.2 Q5.1
N$28  (3 unrouted)
N$29  (1 unrouted)
N$30  (1 unrouted)
N$31  (1 unrouted)
N$32  (1 unrouted)
N$33  (3 unrouted)
N$34  (3 unrouted)
N$35  (3 unrouted)
N$36  (3 unrouted)
N$37  (1 unrouted)
N$38  (1 unrouted)
N$39
  Top 0.254: IC5.6 69.85,17.02 70.36,16.51 71.75,16.51 72.14,16.13 72.14,14.35 73.03,13.46 73.03,11.05 72.64,10.67 72.64,9.31 71.88,8.55 R9.1 IC2.7
N$40
  Top 0.254: JP1.7 71.12,4.57 70.1,5.59 70.1,9.14 70.36,9.4 72.01,9.4 72.14,9.53 72.14,10.97 72.03,11.07 71.22,11.07 71.12,11.18 Q7.3 IC2.12
N$41
  Top 0.254: IC5.7 72.39,16.59 72.64,16.34 72.64,14.56 73.53,13.67 73.53,7.75 IC2.8
  Bottom 0.254: IC2.8 R10.1
N$42
  Top 0.254: IC2.11 73.66,14.26 74.04,13.88 74.04,9.14 74.68,8.51 74.68,5.46 73.66,4.45 JP1.8
  Bottom 0.254: Q8.3 IC2.11
N$43
  Bottom 0.254: R8.2 69.53,11.2 Q6.1
N$44  (1 unrouted)
N$47  (1 unrouted)
N$48  (1 unrouted)
N$49  (1 unrouted)
N$50  (1 unrouted)
N$51  (1 unrouted)
N$52  (1 unrouted)
N$53  (1 unrouted)
N$54  (3 unrouted)
N$55  (3 unrouted)
N$56  (via drill 0.35)  (1 unrouted)
  Top 0.254: IC3.15 55.47,33.88 v55.47,22.76 | v51.31,18.34 51.21,18.24 40.97,18.24 40.01,17.27 38.19,17.27 37.68,16.76 35.76,16.76 35.2,16.2 33.33,16.2 33.02,15.9 33.02,13.92 33.73,13.21 33.73,9.75 32.53,8.55 R11.1
  Bottom 0.254: v55.47,22.76 55.47,19.41 54.65,18.59 51.56,18.59 v51.31,18.34
N$65
  Top 0.254: R9.2 70.17,11.2 Q7.1
N$75
  Top 0.254: IC8.11 48.87,14.58 48.87,10.87 48.56,10.57 48.56,9.54 48.26,9.24 48.26,6.2 49.53,4.93 JP6.8
  Bottom 0.254: Q16.3 IC8.11
N$76  (3 unrouted)
N$77  (3 unrouted)
N$78
  Top 0.254: R3.2 54.93,11.2 Q1.1
N$79
  Bottom 0.254: R4.2 59.37,11.2 Q2.1
N$83  (3 unrouted)
N$84  (3 unrouted)
N$85
  Bottom 0.254: R10.2 74.61,11.2 Q8.1
N$87
  Top 0.254: IC8.18 Q9.3 31.75,11.23 31.9,11.07 32.56,11.07 32.82,10.82 32.82,9.65 32.56,9.4 30.89,9.4 30.58,9.09 30.58,5.79 31.75,4.62 JP6.1
N$88
  Top 0.254: R5.2 60.01,11.2 Q3.1
N$89  (via drill 0.35)  (1 unrouted)
  Top 0.254: IC3.1 56.19,29.52 v56.19,23.47 56.19,23.28 | v52.02,17.88 51.87,17.73 41.18,17.73 40.22,16.76 38.4,16.76 37.89,16.26 35.97,16.26 35.56,15.85 35.56,13.72 34.85,13.01 34.85,8.18 IC8.2
  Bottom 0.254: v56.19,23.47 56.19,19.41 54.66,17.88 v52.02,17.88
N$91
  Top 0.254: IC8.17 34.29,9.5 33.02,8.23 33.02,5.79 34.29,4.52 JP6.2
  Bottom 0.254: Q10.3 IC8.17
N$92  (via drill 0.35)  (1 unrouted)
  Top 0.254: IC3.2 59.69,29.49 58.17,27.96 58.17,24.54 55.01,21.38 v54.87,21.38 | R13.1 37.5,8.55 38.81,9.86 38.81,13.01 38.3,13.51 38.3,15.95 38.61,16.26 40.43,16.26 41.4,17.22 52.36,17.22 54.36,19.22 v54.36,19.3
  Bottom 0.254: v54.36,19.3 54.97,19.91 54.97,21.34 54.91,21.34 v54.87,21.38
N$93
  Top 0.254: IC8.16 Q11.3 36.83,11.12 36.88,11.07 37.59,11.07 37.8,10.87 37.8,9.65 37.54,9.4 36.02,9.4 35.56,8.94 35.56,5.79 36.83,4.52 JP6.3
N$94  (1 unrouted)
  Top 0.254: IC3.3 60.1,28.35 59.27,28.35 58.67,27.75 58.67,24.33 55.12,20.78 55.12,18.19 54.04,18.19 52.57,16.71 41.6,16.71 40.64,15.75 40.64,14.02 40.03,13.41 40.03,8.28 IC8.4
N$95
  Top 0.254: IC8.15 39.37,9.5 38.1,8.23 38.1,5.79 39.37,4.52 JP6.4
  Bottom 0.254: Q12.3 IC8.15
N$96
  Top 0.254: IC3.4 65.79,29.46 65.79,24.29 64.15,22.66 57.81,22.66 56.79,21.64 56.75,21.64 55.63,20.52 55.63,17.68 54.25,17.68 52.78,16.2 43.84,16.2 43.18,15.54 43.18,13.72 43.79,13.11 43.79,9.85 42.83,8.89 42.25,8.89 R15.1 IC8.5
N$97
  Top 0.254: IC8.14 Q13.3 41.91,11.23 42.06,11.07 42.77,11.07 42.88,10.97 42.88,9.65 42.62,9.4 41.15,9.4 40.89,9.14 40.89,5.74 41.91,4.72 JP6.5
N$98  (via drill 0.35)  (1 unrouted)
  Top 0.254: IC3.5 66.29,29.46 66.29,24.08 64.36,22.15 60.71,22.15 60.35,21.79 v60.35,21.74 | v53.75,16.15 53.75,13.71 v53.84,13.61
  Bottom 0.254: v60.35,21.74 60.05,21.74 58.67,20.42 58.67,17.83 58.12,17.27 54.86,17.27 v53.75,16.15 | v53.84,13.61 53.84,11.28 50.8,8.23 50.8,7.21 49.78,6.2 45.87,6.2 IC8.6
N$99
  Top 0.254: IC8.13 44.45,9.5 43.18,8.23 43.18,5.69 44.45,4.42 JP6.6
  Bottom 0.254: Q14.3 IC8.13
N$100  (via drill 0.35)  (1 unrouted)
  Top 0.254: IC3.6 70.87,29.46 70.87,23.98 68.53,21.64 62.23,21.64 62.03,21.44 v61.57,21.44
  Bottom 0.254: v61.57,21.44 60.71,20.57 60.71,17.33 60.14,16.76 55.32,16.76 52.73,14.17 52.73,11.99 50.38,9.64 50.38,9.62 50.16,9.4 48.62,9.4 46.99,7.77 IC8.7
N$101
  Top 0.254: IC8.12 Q15.3 46.99,11.23 47.14,11.07 47.65,11.07 48.06,10.67 48.06,9.75 47.7,9.4 46.13,9.4 45.97,9.25 45.97,6.15 46.94,5.18 46.94,3.28 JP6.7
N$102  (via drill 0.35)  (1 unrouted)
  Top 0.254: IC3.7 71.37,29.46 71.37,23.67 68.83,21.13 62.59,21.13 v62.38,20.93
  Bottom 0.254: v62.38,20.93 62.18,20.73 61.81,20.73 61.21,20.13 61.21,17.12 60.35,16.26 55.98,16.26 55.93,16.2 55.48,16.2 53.24,13.96 53.24,11.58 50.2,8.55 R18.1
N$104
  Top 0.254: R11.2 30.8,11.2 Q9.1
N$105
  Bottom 0.254: R12.2 35.24,11.2 Q10.1
N$106
  Top 0.254: R13.2 35.88,11.2 Q11.1
N$107
  Bottom 0.254: R14.2 40.32,11.2 Q12.1
N$108
  Top 0.254: R15.2 40.96,11.2 Q13.1
N$109
  Bottom 0.254: R16.2 45.4,11.2 Q14.1
N$110
  Top 0.254: R17.2 46.04,11.2 Q15.1
N$111
  Bottom 0.254: R18.2 50.48,11.2 Q16.1
OLAT
  Top 0.254: IC5.12 68.33,27.69 68.33,32.77 67.31,33.78 IC3.12 67.31,40.64 | 67.31,40.64 R21.1 | U$1.PA8 66.04,44.45 66.04,41.91 67.31,40.64
PWR_POS  (1 unrouted)
SCK  (via drill 0.35)  (2 unrouted)
  Top 0.254: IC5.11 68.83,27.69 68.83,32.72 69.85,33.73 v69.85,34.24 IC3.11 R19.1
  Bottom 0.254: U$1.PB3 69.9,34.29 v69.85,34.24
SLNK1  (via drill 0.35)
  Top 0.254: v65.63,32.92 62.23,36.32 IC3.14 | v73.36,32.92 73.36,32.47 73.91,31.91 73.91,28.5 74.93,27.48 IC5.9
  Bottom 0.254: v73.36,32.92 v65.63,32.92
SW  (3 unrouted)
TIN1  (via drill 0.35)
  Top 0.254: IC9.3 U$3.4 45.47,35.31 49.4,35.31 49.91,35.81 49.91,37.04 50.97,38.1 53.47,38.1 53.72,38.35 53.72,40.26 58.42,44.96 76.33,44.96 76.83,45.47 v77.47,45.47
  Bottom 0.254: U$1.PB1 80.01,45.72 77.72,45.72 v77.47,45.47
TIN2
  Top 0.254: IC9.5 43.18,26.67 U$2.2
TIN3
  Bottom 0.254: U$2.4 44.58,21.59 46.63,23.65 46.63,27.58 IC9.10
TIN4
  Top 0.254: U$1.PB2 80.39,46.99 79.12,45.72 78.23,45.72 77.85,46.1 76.75,46.1 76.12,45.47 57.65,45.47 53.13,40.95 46.02,40.95 U$3.2
  Bottom 0.254: U$3.2 46.35,39.37 46.35,34.29 IC9.12
TIN5  (1 unrouted)
TIN6  (1 unrouted)
TIN7  (1 unrouted)
TIN8  (1 unrouted)
TOUT1  (via drill 0.35)  (2 unrouted)
  Top 0.254: v50.16,38.35 42.55,38.35 42.55,39.37 IC9.1 | U$3.5 54.46,31.9 54.46,23.32 53.72,22.58 53.72,20.57 52.6,19.45 50.85,19.45 50.65,19.25 40.55,19.25 39.59,18.29 37.77,18.29 37.26,17.78 26.29,17.78
  Bottom 0.254: U$3.5 50.16,34.29 v50.16,38.35
TOUT2  (2 unrouted)
  Top 0.254: 26.54,18.8 36.84,18.8 37.34,19.3 39.17,19.3 40.64,20.78 IC9.7 41.66,25.15 49.15,25.15 50.67,26.67 U$2.7
TOUT3  (2 unrouted)
  Top 0.254: 26.42,18.29 37.05,18.29 37.56,18.8 39.38,18.8 40.34,19.76 50.44,19.76 52.07,21.39 U$2.5 50.8,21.59 IC9.8
TOUT4  (via drill 0.35)  (3 unrouted)
  Top 0.254: IC9.14 U$3.7 | v54.1,37.59 54.97,36.73 54.97,29.59 | 54.97,29.72 54.97,23.11 54.23,22.37 54.23,20.16 53.01,18.94 51.06,18.94 50.86,18.75 40.76,18.75 39.8,17.78 37.98,17.78 37.47,17.27 26.29,17.27
  Bottom 0.254: U$3.7 52.32,39.37 v54.1,37.59
TOUT5  (3 unrouted)
TOUT6  (3 unrouted)
TOUT7  (3 unrouted)
TOUT8  (3 unrouted)
VCC  (1 unrouted)

### Text on the board
tNames: JP4: / PWR / =OUT / || IN / :: LOC